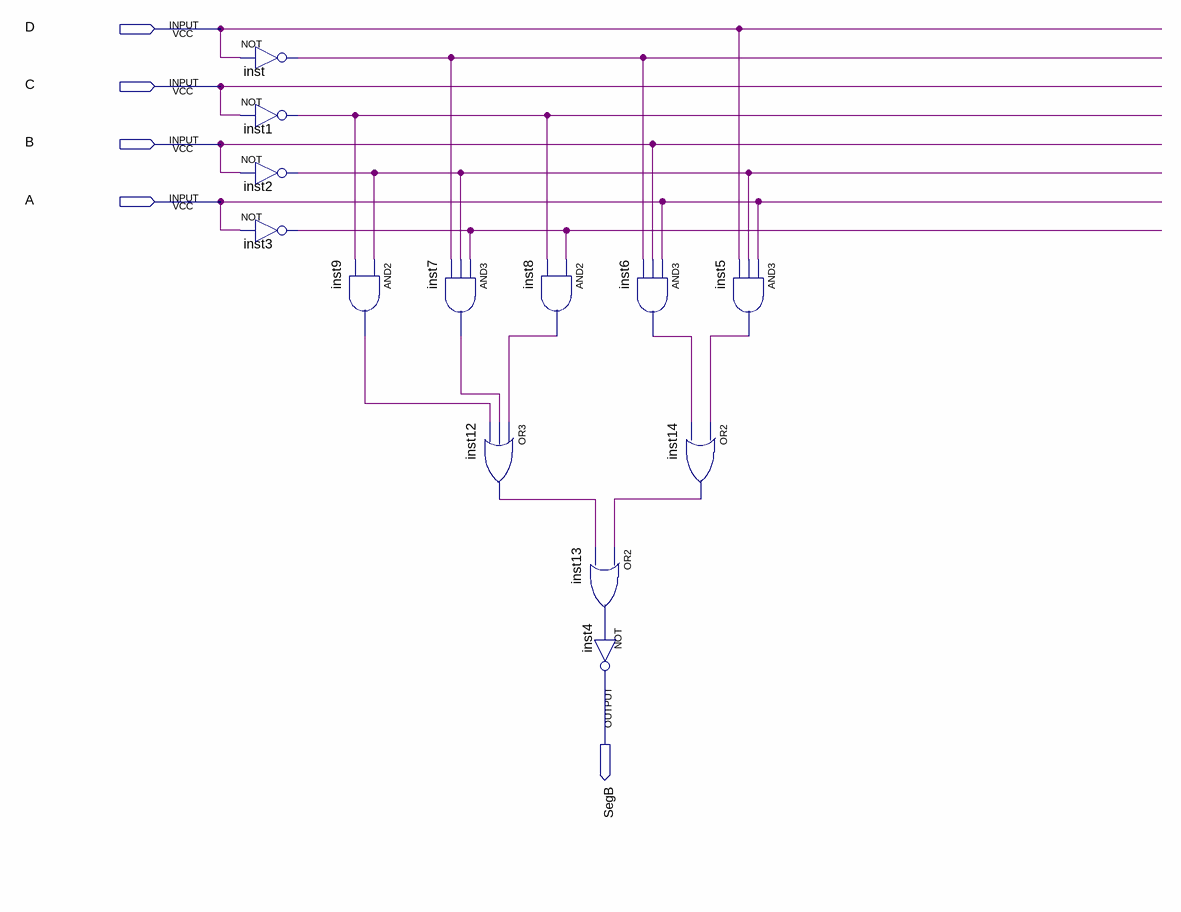
[diagram p0: schematic sheet]
// Quartus schematic SegB.bdf as structural Verilog: 13 symbols, 5 pins
module SegB (
  input  D,
  input  C,
  input  B,
  input  A,
  output SegB
);

  wire inst1_out, inst2_out, inst3_out, inst5_out, inst6_out, inst7_out, inst8_out, inst9_out, inst12_out,
       inst13_out, inst14_out, inst_out;

  not inst (inst_out, D);
  not inst1 (inst1_out, C);
  not inst2 (inst2_out, B);
  not inst3 (inst3_out, A);
  and inst9 (inst9_out, inst2_out, inst1_out);
  and inst7 (inst7_out, inst3_out, inst2_out, inst_out);
  or inst12 (inst12_out, inst8_out, inst7_out, inst9_out);
  and inst8 (inst8_out, inst3_out, inst1_out);
  and inst6 (inst6_out, A, B, inst_out);
  or inst13 (inst13_out, inst14_out, inst12_out);
  not inst4 (SegB, inst13_out);
  and inst5 (inst5_out, A, inst2_out, D);
  or inst14 (inst14_out, inst5_out, inst6_out);
endmodule
